# EAGLE design WirelessTRV (EAGLE 6.2)
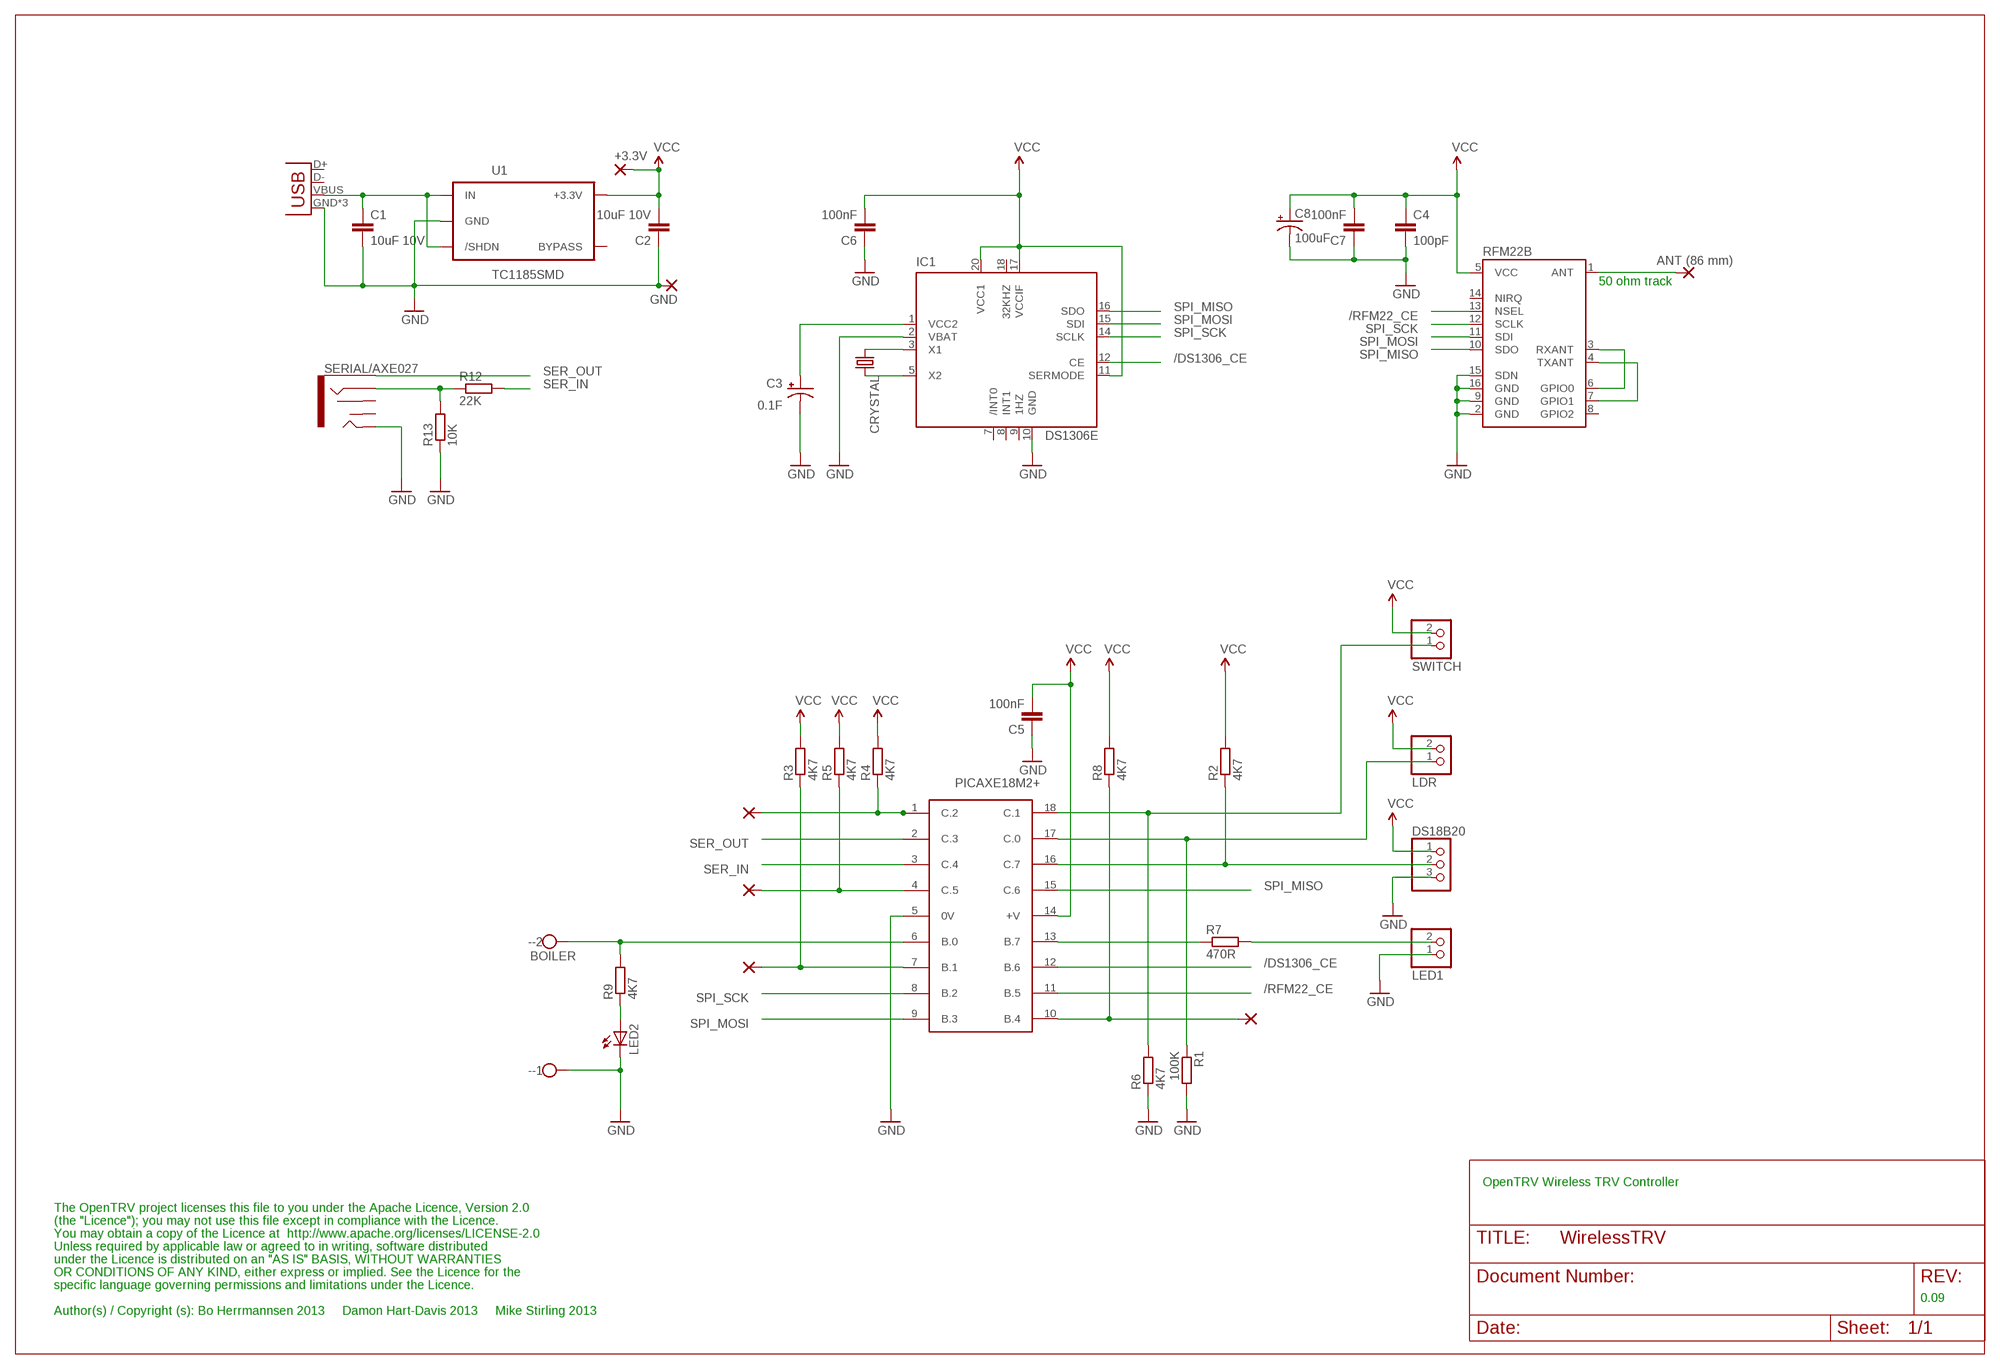
[diagram p0: schematic, sheet 1]

## Parts
1  2,15/1,0  [2,15/1,0]
4  2,15/1,0  [2,15/1,0]
5V  USB-MICROB  [USB-MICROB]
7  2,15/1,0  [2,15/1,0]
10  2,15/1,0  [2,15/1,0]
+3.3V  2,15/1,0  [2,15/1,0]
-  BOILER  W237-102  [W237-102]
ANT  ANT (86 mm)  2,15/1,0  [2,15/1,0]
C1  10uF 10V  CAP0603-CAP  [0603-CAP]
C2  10uF 10V  CAP0603-CAP  [0603-CAP]
C3  0.1F  SUPERCAP3.6VSUPERCAP3.6V  [SUPERCAP3.6V]
C4  100pF  CAP0603-CAP  [0603-CAP]
C5  100nF  CAP0603-CAP  [0603-CAP]
C6  100nF  CAP0603-CAP  [0603-CAP]
C7  100nF  CAP0603-CAP  [0603-CAP]
C8  100uF  CAP_POL1206  [EIA3216]
CRYSTAL  MC-306  [MC-306]
DS18B20  PINHD-1X3  [1X03]
GND  2,15/1,0  [2,15/1,0]
IC1  DS1306E  [TSSOP20]
LDR  PINHD-1X2  [1X02]
LED1  PINHD-1X2  [1X02]
LED2  LED2012  [LED2012]
PICAXE18M2+  PICAXE18M2SO  [SO-18W]
R1  100K  R-EU_R0603  [R0603]
R2  4K7  R-EU_R0603  [R0603]
R3  4K7  R-EU_R0603  [R0603]
R4  4K7  R-EU_R0603  [R0603]
R5  4K7  R-EU_R0603  [R0603]
R6  4K7  R-EU_R0603  [R0603]
R7  470R  R-EU_R0603  [R0603]
R8  4K7  R-EU_R0603  [R0603]
R9  4K7  R-EU_R0603  [R0603]
R12  22K  R-EU_R0603  [R0603]
R13  10K  R-EU_R0603  [R0603]
RFM22B  RFM22SMD  [RFM22-XXX-S2]
SERIAL/AXE027  AUDIO-JACK2SMD  [AUDIO-JACK-3.5MM-SMD]
SWITCH  PINHD-1X2  [1X02]
U1  TC1185SMD  [TC1185]

## Nets
/DS1306_CE: IC1.12(CE) PICAXE18M2+.12(B.6)
/RFM22_CE: PICAXE18M2+.11(B.5) RFM22B.13(NSEL)
BOILER: -.2 PICAXE18M2+.6(B.0) R9.2
GND: 5V.GND 5V.MT1(GND) 5V.MT2(GND) -.1 C1.2 C2.1 C3.- C4.2 C5.1 C6.1 C7.1 C8.C(-) DS18B20.3 GND.1(P) IC1.2(VBAT) IC1.10(GND) LED1.1 LED2.2(C) PICAXE18M2+.5(0V) R1.2 R6.1 R13.1 RFM22B.2(GND) RFM22B.9(GND) RFM22B.15(SDN) RFM22B.16(GND) SERIAL/AXE027.TIP U1.2(GND)
LDR: LDR.1 PICAXE18M2+.17(C.0) R1.1
LED: PICAXE18M2+.13(B.7) R7.1
LEDEXT: LED1.2 R7.2
N$1: 10.1(P) PICAXE18M2+.10(B.4) R8.1
N$2: CRYSTAL.1 IC1.3(X1)
N$3: 4.1(P) PICAXE18M2+.4(C.5) R5.1
N$7: R12.1 R13.2 SERIAL/AXE027.RING
N$9: LED2.1(A) R9.1
N$11: 1.1(P) PICAXE18M2+.1(C.2) R4.1
N$15: 7.1(P) PICAXE18M2+.7(B.1) R3.1
N$16: CRYSTAL.4 IC1.5(X2)
N$20: RFM22B.3(RXANT) RFM22B.6(GPIO0)
N$21: RFM22B.4(TXANT) RFM22B.7(GPIO1)
N$23: C3.+ IC1.1(VCC2)
N$25: 5V.VBUS C1.1 U1.1(IN) U1.3(/SHDN)
N$26: ANT.1(P) RFM22B.1(ANT)
ONE_WIRE: DS18B20.2 PICAXE18M2+.16(C.7) R2.1
SER_IN: PICAXE18M2+.3(C.4) R12.2
SER_OUT: PICAXE18M2+.2(C.3) SERIAL/AXE027.SLEEVE
SPI_MISO: IC1.16(SDO) PICAXE18M2+.15(C.6) RFM22B.10(SDO)
SPI_MOSI: IC1.15(SDI) PICAXE18M2+.9(B.3) RFM22B.11(SDI)
SPI_SCK: IC1.14(SCLK) PICAXE18M2+.8(B.2) RFM22B.12(SCLK)
SWITCH: PICAXE18M2+.18(C.1) R6.2 SWITCH.1
VCC: +3.3V.1(P) C2.2 C4.1 C5.2 C6.2 C7.2 C8.A(+) DS18B20.1 IC1.11(SERMODE) IC1.17(VCCIF) IC1.20(VCC1) LDR.2 PICAXE18M2+.14(+V) R2.2 R3.2 R4.2 R5.2 R8.2 RFM22B.5(VCC) SWITCH.2 U1.5(+3.3V)
Unconnected: 5V.D+ 5V.D- IC1.7(/INT0) IC1.8(INT1) IC1.9(1HZ) IC1.18(32KHZ) RFM22B.8(GPIO2) RFM22B.14(NIRQ) SERIAL/AXE027.RSH SERIAL/AXE027.TSH U1.4(BYPASS)

## Notes on the sheet
- 50 ohm track
- OpenTRV Wireless TRV Controller
- The OpenTRV project licenses this file to you under the Apache Licence, Version 2.0
- (the "Licence"); you may not use this file except in compliance with the Licence.
- You may obtain a copy of the Licence at  http://www.apache.org/licenses/LICENSE-2.0
- Unless required by applicable law or agreed to in writing, software distributed
- under the Licence is distributed on an "AS IS" BASIS, WITHOUT WARRANTIES
- OR CONDITIONS OF ANY KIND, either express or implied. See the Licence for the
- specific language governing permissions and limitations under the Licence.
- 0.09
- Author(s) / Copyright (s): Bo Herrmannsen 2013     Damon Hart-Davis 2013     Mike Stirling 2013

## Library data of the parts
1 4 7 10 +3.3V ANT GND = wirepad:2,15/1,0: THROUGH-HOLE PAD
5V = SparkFun-Connectors:USB: USB Connectors USB-B-PTH is fully proven SKU : PRT-00139 USB-miniB is fully proven SKU : PRT-00587 USB-A-PCB is untested. USB-A-H is throughly reviewed, but untested. Spark Fun Electronics SKU : PRT-00437 USB-B-SMT is throughly reviewed, but untested. Needs silkscreen touching up. USB-A-S has not been used/tested USB-MB-H has not been used/tested
- = con-wago-500:W237-102: WAGO SCREW CLAMP; MPN: 237-102; OC_FARNELL: unknown; OC_NEWARK: 70K9898
C1 C2 C4-C7 = SparkFun-Passives:CAP: Capacitor Standard 0603 ceramic capacitor, and 0.1" leaded capacitor.
C3 = supwecap3.6v:SUPERCAP3.6V: Capacitor Polarized These are standard SMD and PTH capacitors. Normally 10uF, 47uF, and 100uF in electrolytic and tantalum varieties. Always verify the external diameter of the through hole cap, it varies with capacity, voltage, and manufacturer. The EIA devices should be standard.
C8 = SparkFun-Passives:CAP_POL: Capacitor Polarized These are standard SMD and PTH capacitors. Normally 10uF, 47uF, and 100uF in electrolytic and tantalum varieties. Always verify the external diameter of the through hole cap, it varies with capacity, voltage, and manufacturer. The EIA devices should be standard.
CRYSTAL = crystal:MC-306: kHz RANGE CRYSTAL UNIT SMD Source: MC-306_405_406_E07X.PDF Homepage <http://www.epsontoyocom.co.jp>; MPN: MC-306 60.0KHZ 100PPM ,12.5PF; OC_FARNELL: 1278040; OC_NEWARK: 31M5576
DS18B20 = pinhead:PINHD-1X3: PIN HEADER
IC1 = DS1306:DS1306: Serial Alarm Real-Time Clock
LDR LED1 SWITCH = pinhead:PINHD-1X2: PIN HEADER
LED2 = LED2012:LED2012
PICAXE18M2+ = picaxe18m2:PICAXE18M2: PICAXE-18M2 BASIC Microcontroller
R1-R9 R12 R13 = resistor:R-EU_: RESISTOR, European symbol
RFM22B = SparkFun-RF:RFM22: The RFM22 is a low-power, low cost radio that is capable of operating in the 434MHz and 900MHz open bands. It's frequency is software defined and there are some very good libraries written for it.
SERIAL/AXE027 = SparkFun-Connectors:AUDIO-JACK2: Stereo audio jack with bypass switches.
U1 = 3.3VREG:TC1185

## Board
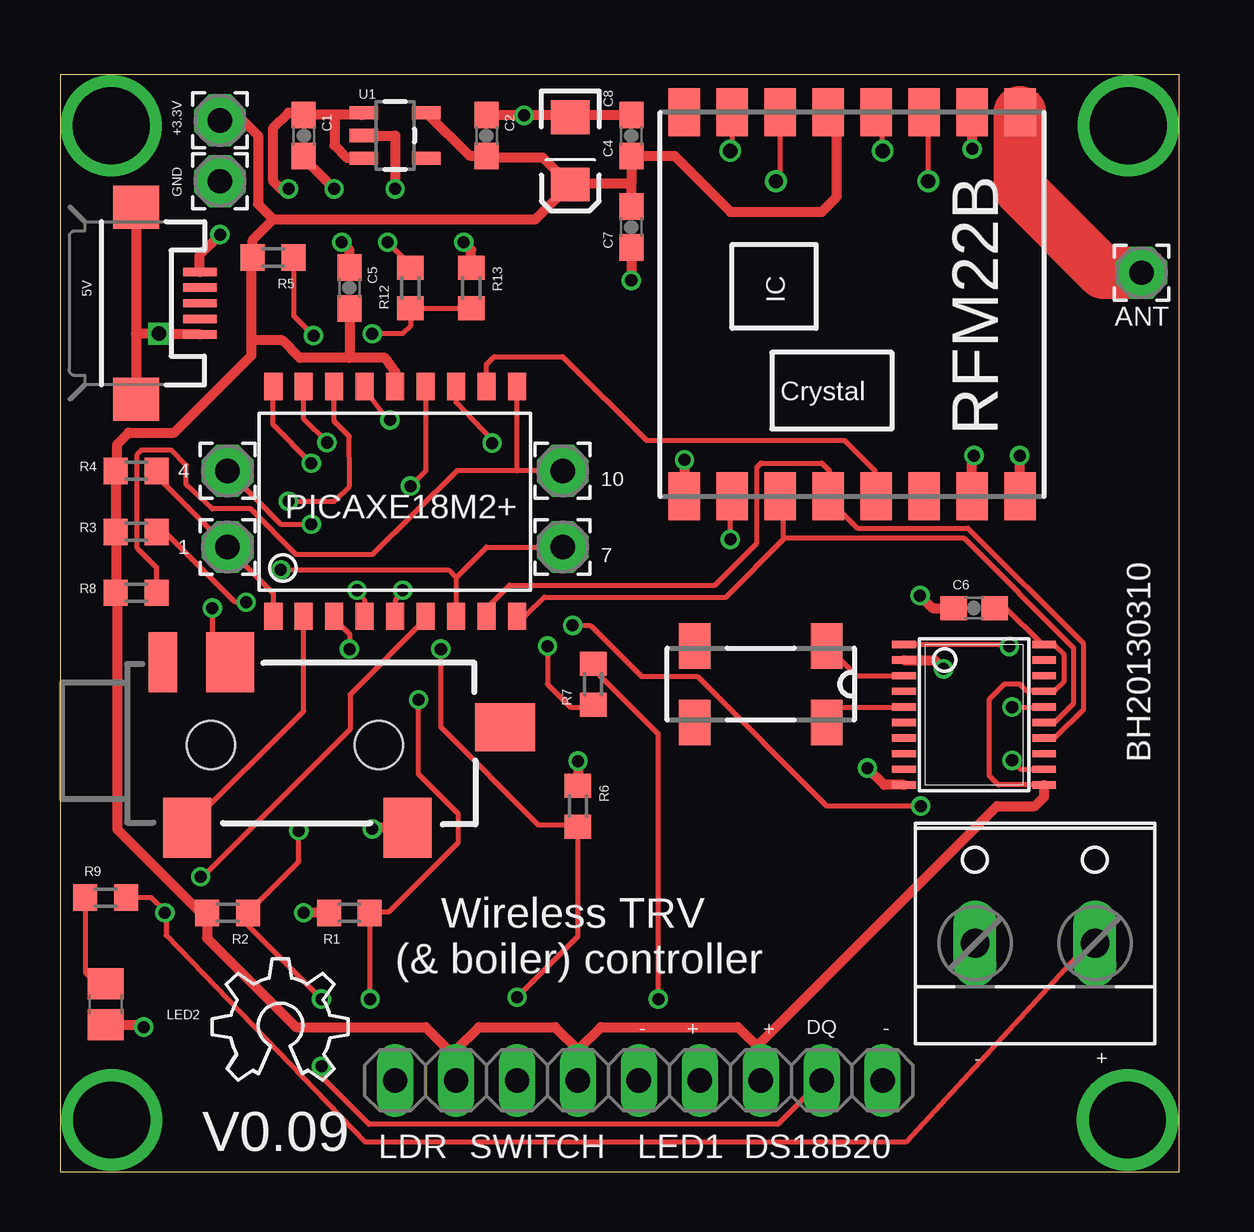
[diagram p1: board, top side]
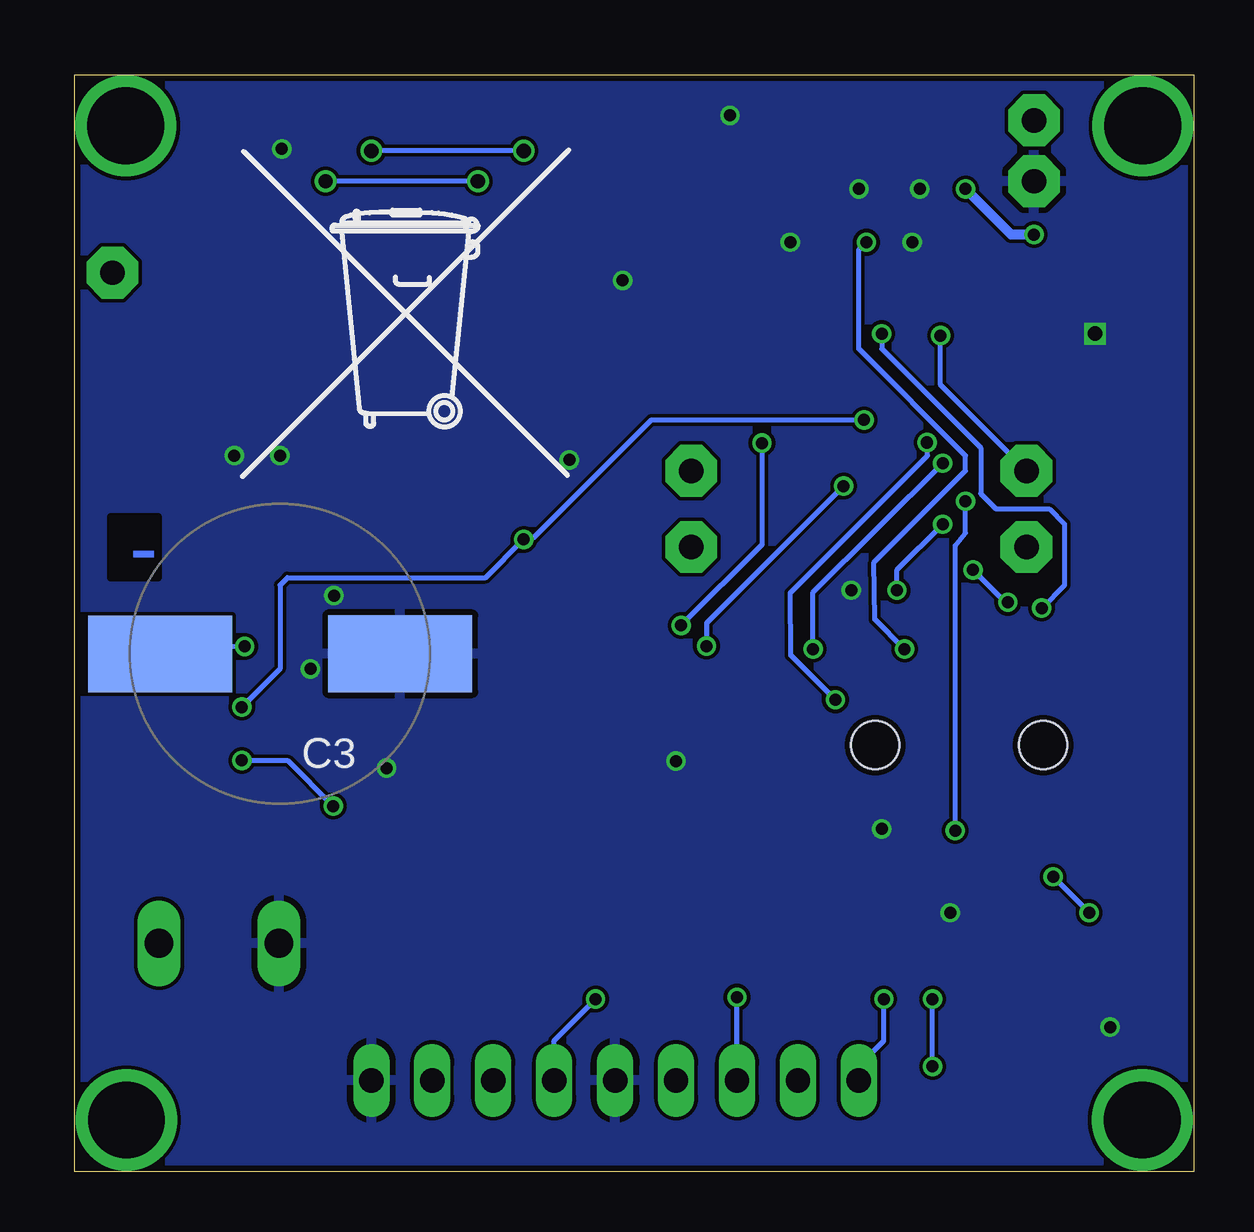
[diagram p2: board, bottom side, seen from below]

Size 46.66 x 45.71 mm. Coordinates in mm from the lower left corner, seen from the top.
Outline: 0,0 46.66,0 46.66,45.71 0,45.71 0,0
Copper layers (1*16): Top 0.035mm / dielectric 1.5mm / Bottom 0.035mm
Design rules: minimum track width 6mil, minimum drill 12mil, track to track 6mil, track to pad 6mil, pad to pad 6mil, via to via 6mil, smd to smd 0mil, copper to edge 10mil, drill to drill 10mil, minimum pad ring 10mil, minimum via ring 6mil, stop-mask expansion 2mil, vias tented up to drill 100mil, thermal gap 10mil

### Footprints (pad centres in the part's own frame; a part is rotated, then mirrored left to right if it is on the bottom)
2,15/1,0 = drill 1.016 pad 2.159 octagon: 1 0,0
USB-MICROB = smd 0.35 x 1.4: D+ 0,2.65; D- -0.65,2.65; GND 1.3,2.65; ID 0.65,2.65; VBUS -1.3,2.65 | smd 1.8 x 1.9: MT1 -4,0; MT2 4,0
W237-102 = drill 1.194 long: 1 -2.5,-1.27; 2 2.5,-1.27
0603-CAP = smd 1.1 x 1: 1 -0.85,0; 2 0.85,0
SUPERCAP3.6V = smd 6 x 3.2: + 4.99,0.01; - -5.01,0
EIA3216 = smd 1.4 x 1.6: A 1.4,0; C -1.4,0
MC-306 = smd 1.3 x 1.9: 1 -2.75,-1.6; 2 2.75,-1.6; 3 2.75,1.6; 4 -2.75,1.6
1X03 = drill 1.016 long: 1 -2.54,0; 2 0,0; 3 2.54,0
TSSOP20 = smd 0.305 x 0.991: 1 -2.925,-2.918; 2 -2.275,-2.918; 3 -1.625,-2.918; 4 -0.975,-2.918; 5 -0.325,-2.918; 6 0.325,-2.918; 7 0.975,-2.918; 8 1.625,-2.918; 9 2.275,-2.918; 10 2.925,-2.918; 11 2.925,2.918; 12 2.275,2.918; 13 1.625,2.918; 14 0.975,2.918; 15 0.325,2.918; 16 -0.325,2.918; 17 -0.975,2.918; 18 -1.625,2.918; 19 -2.275,2.918; 20 -2.925,2.918
1X02 = drill 1.016 long: 1 -1.27,0; 2 1.27,0
LED2012 = smd 1.3 x 1.5: 1 -0.85,0; 2 0.85,0
SO-18W = smd 0.762 x 1.143: 1 -5.08,-4.788; 2 -3.81,-4.788; 3 -2.54,-4.788; 4 -1.27,-4.788; 5 0,-4.788; 6 1.27,-4.788; 7 2.54,-4.788; 8 3.81,-4.788; 9 5.08,-4.788; 10 5.08,4.788; 11 3.81,4.788; 12 2.54,4.788; 13 1.27,4.788; 14 0,4.788; 15 -1.27,4.788; 16 -2.54,4.788; 17 -3.81,4.788; 18 -5.08,4.788
R0603 = smd 1 x 1.1: 1 -0.85,0; 2 0.85,0
RFM22-XXX-S2 = smd 2 x 1.3: 1 -8,7; 2 -8,5; 3 -8,3; 4 -8,1; 5 -8,-1; 6 -8,-3; 7 -8,-5; 8 -8,-7; 9 8,-7; 10 8,-5; 11 8,-3; 12 8,-1; 13 8,1; 14 8,3; 15 8,5; 16 8,7
AUDIO-JACK-3.5MM-SMD = smd 2 x 2.5: RING 4.3,3.45; SLEEVE 2.5,-3.45; TIP 11.7,-3.45 | smd 1.2 x 2.5: RSH 1.5,3.45 | smd 2.5 x 2: TSH 15.75,0.75 | hole 2: 3.5,0; 10.5,0
TC1185 = smd 0.55 x 1.2: 1 -0.95,-1.3; 2 0,-1.3; 3 0.95,-1.3; 4 0.95,1.3; 5 -0.95,1.3

### Placement (x,y rotation side)
1  6.99,26.04 90 top
4  6.99,29.21 90 top
5V  3.17,36.2 270 top
7  20.95,26.04 90 top
10  20.95,29.21 90 top
+3.3V  6.67,43.81 0 top
-  40.64,10.79 0 top
ANT  45.09,37.47 180 top
C1  10.16,43.18 270 top
C2  17.78,43.18 270 top
C3  38.1,21.59 180 bottom
C4  23.81,43.18 90 top
C5  12.06,36.83 270 top
C6  38.1,23.5 0 top
C7  23.81,39.37 90 top
C8  21.27,42.55 270 top
CRYSTAL  29.21,20.32 180 top
DS18B20  31.75,3.81 0 top
GND  6.67,41.27 0 top
IC1  38.1,19.05 270 top
LDR  15.24,3.81 0 top
LED1  25.4,3.81 0 top
LED2  1.91,6.99 270 top
PICAXE18M2+  13.97,27.94 0 top
R1  12.06,10.79 180 top
R2  6.99,10.79 180 top
R3  3.17,26.67 180 top
R4  3.17,29.21 180 top
R5  8.89,38.1 180 top
R6  21.59,15.24 270 top
R7  22.23,20.32 90 top
R8  3.17,24.13 180 top
R9  1.91,11.43 0 top
R12  14.61,36.83 90 top
R13  17.14,36.83 270 top
RFM22B  33.02,36.14 270 top
SERIAL/AXE027  2.79,17.78 0 top
SWITCH  20.32,3.81 0 top
U1  13.97,43.18 270 top
U$2  [TONNE]  33.02,33.02 0 bottom
U$3  [OSHW_6X200_NOTEXT]  6.35,3.81 0 top

### Tracks (layer width: path | path; a pad name or v marks a point on that pad's centre or on a via)
/DS1306_CE  (via drill 0.5)
  Top 0.203: v21.37,22.77 22.11,22.77 24.23,20.65 26.57,20.65 31.98,15.24 v35.88,15.24 | v18.01,30.37 18.01,30.48 16.51,32.07 PICAXE18M2+.12 | IC1.12 41,16.76 40.07,16.76 v39.69,17.14
  Bottom 0.203: v21.37,22.77 18.01,26.14 v18.01,30.37 | v39.69,17.14 37.78,17.14 v35.88,15.24
/RFM22_CE
  Top 0.203: PICAXE18M2+.11 17.78,33.66 18.1,33.97 20.95,33.97 24.45,30.48 32.7,30.48 33.97,29.21 33.97,28.19 RFM22B.13
BOILER  (via drill 0.5)
  Top 0.203: R9.2 3.81,11.43 4.37,10.87 v4.37,10.79 4.42,10.72 4.42,9.86 12.7,1.26 35.29,1.26 42.61,9.21 -.2 | v5.87,12.29 5.94,12.29 12.09,18.44 12.09,19.89 15.24,23.04 PICAXE18M2+.6
  Bottom 0.203: v5.87,12.29 v4.37,10.79
GND  (via drill 0.5, 0.6)
  Top 0.203: 21.54,44.02 21.59,43.97 C8.C | 17.78,44.02 C2.1 | IC1.10 | RFM22B.15 | 40.01,28.14 RFM22B.16 | RFM22B.2 38.02,44.04 | RFM22B.9 26.04,28.25 | v14.29,24.23 14.29,24.13 13.97,23.81 PICAXE18M2+.5
  Top 0.406: 21.54,44.02 v19.34,44.02 17.78,44.02 | v21.59,17.12 R6.1 | C6.1 36.37,23.5 v35.85,24.02 | v26.04,29.67 26.04,28.25 | v38.02,42.62 38.02,44.04 | U1.2 13.97,43.18 v13.97,40.96 | C1.2 10.16,42.23 v11.43,40.96 | C4.2 21.36,44.03 C8.C | C7.1 v23.81,37.15 | C5.1 12.06,38.42 v11.75,38.73 | R13.1 17.14,38.42 v16.83,38.73 | RFM22B.15 38.02,29.77 v38.1,29.84 | RFM22B.16 v40.02,29.83 v40.01,29.84 | LED2.2 3.39,6.13 v3.49,6.03 | R1.2 v10.16,10.79 | IC1.2 36.46,21.32 v36.83,20.95 | IC1.10 34.36,16.12 v33.66,16.83 | SERIAL/AXE027.TIP 13.06,14.33 v13.02,14.29 | 5V.GND 4.13,34.9 v4.13,34.92 3.17,34.92 | 3.17,34.92 5V.MT2 | 5V.MT1 3.17,34.92
  pour Bottom: 0,45.72 0,0 46.99,0 46.35,45.72
LDR  (via drill 0.5)
  Top 0.203: v12.93,7.2 12.93,10.79 R1.1 13.01,10.85 13.72,10.85 16.61,13.74 16.61,14.91 14.95,16.57 v14.95,19.67 | PICAXE18M2+.17 10.16,31.36 v11.12,30.39
  Bottom 0.203: v12.93,7.2 12.93,5.46 13.97,4.42 LDR.1 | v11.12,30.39 11.11,29.84 16.83,24.13 16.8,21.53 v14.95,19.67
LED  (via drill 0.5)
  Top 0.203: PICAXE18M2+.13 15.24,29.21 v14.61,28.57 | v20.32,21.91 20.32,20.32 21.27,19.37 22.12,19.37 R7.1
  Bottom 0.203: v14.61,28.57 20.32,22.86 v20.32,21.91
LEDEXT  (via drill 0.5)
  Top 0.203: R7.2 22.23,20.95 24.94,18.24 v24.94,7.2
  Bottom 0.203: v24.94,7.2 26.67,5.47 LED1.2
N$1
  Top 0.203: 10.1 19.05,29.21 | 19.05,29.21 16.55,29.21 13.02,25.72 9.84,25.72 7.94,27.62 6.35,27.62 5.27,28.63 5.27,29.45 4.65,30.07 3.4,30.07 3.2,29.87 3.2,26.01 4.01,25.2 R8.1 | 19.05,29.21 PICAXE18M2+.10
N$2
  Top 0.203: IC1.3 33.2,20.68 31.98,21.89 CRYSTAL.1
N$3  (via drill 0.5)
  Top 0.203: v10.57,34.85 9.75,35.66 9.75,38.1 R5.1 | v12.38,24.23 12.7,23.81 PICAXE18M2+.4 | v10.48,26.99 9.21,26.99 7.01,29.21 4.1
  Bottom 0.203: v10.57,34.85 10.57,32.79 4.1 | v12.38,24.23 12.38,25.08 v10.48,26.99
N$4  (via drill 3.2)
  other vias: 2.13,43.59
N$7  (via drill 0.5)
  Top 0.203: R13.2 R12.1 14.61,35.24 14.29,34.92 v13.02,34.92 | v6.35,23.5 6.35,21.97 SERIAL/AXE027.RING
  Bottom 0.203: v13.02,34.92 13.02,34.29 8.89,30.16 8.89,28.26 8.26,27.62 6.03,27.62 5.4,26.99 5.4,24.45 v6.35,23.5
N$9
  Top 0.203: R9.1 1.07,8.31 1.42,7.95 LED2.1
N$11
  Top 0.203: R4.1 4.04,29.21 4.04,28.98 1.1 7.04,25.96 8.89,24.11 8.89,23.16 PICAXE18M2+.1
N$12  (via drill 3.2)
  other vias: 44.5,2.16
N$15  (via drill 0.5)
  Top 0.203: R3.1 4.37,26.67 7.3,23.74 v7.76,23.74 | v9.21,25.08 16.19,25.08 16.51,24.77 | 16.51,24.77 PICAXE18M2+.7 | 16.51,24.77 17.78,26.04 7.1
  Bottom 0.203: v7.76,23.74 7.86,23.74 v9.21,25.08
N$16
  Top 0.203: IC1.5 35.18,19.36 32.59,19.36 31.98,18.75 CRYSTAL.4
N$19  (via drill 3.2)
  other vias: 44.53,43.59
N$20  (via drill 0.6)
  Top 0.203: RFM22B.6 30.02,41.45 v29.84,41.27 | v36.2,41.27 36.2,43.97 RFM22B.3
  Bottom 0.203: v29.84,41.27 v36.2,41.27
N$21  (via drill 0.6)
  Top 0.203: RFM22B.7 28.02,42.62 v27.94,42.55 | v34.29,42.55 34.29,43.87 RFM22B.4
  Bottom 0.203: v27.94,42.55 v34.29,42.55
N$22  (via drill 3.2)
  other vias: 2.16,2.16
N$23  (via drill 0.5)
  Top 0.203: v39.57,21.89 39.5,21.97 35.2,21.97 IC1.1
  Bottom 0.203: v39.57,21.89 42.77,21.89 43.08,21.59 C3.+
N$25  (via drill 0.5)
  Top 0.203: 12.57,44.04 12.65,44.12 U1.1 | 10.16,44.04 C1.1 | U1.3 12.65,42.23 12.65,42.24
  Top 0.406: 12.57,44.04 11.44,44.04 | 11.44,44.04 10.16,44.04 | 11.44,44.04 11.44,42.77 11.98,42.24 12.29,42.24 12.3,42.23 12.65,42.23 | 5V.VBUS 5.83,38.21 v6.67,39.05 | v9.53,40.96 9.21,40.96 8.89,41.27 8.89,43.5 9.53,44.13 10.06,44.13 C1.1
  Bottom 0.406: v6.67,39.05 7.62,39.05 v9.53,40.96
N$26
  Top 2.184: RFM22B.1 40.01,42.87 40.01,40.96 43.5,37.47 ANT.1
ONE_WIRE  (via drill 0.5)
  Top 0.203: v10.9,7.2 7.85,10.25 7.85,10.79 R2.1 7.9,10.87 9.96,12.93 v9.96,14.22 | v10.9,4.39 10.9,3.96 12.88,1.98 29.92,1.98 DS18B20.2 | PICAXE18M2+.16 11.43,31.27 12.05,30.64 12.06,28.89 12.06,28.57 11.43,27.94 v9.53,27.94
  Bottom 0.203: v10.9,4.39 v10.9,7.2 | v9.53,27.94 9.53,26.62 9.96,26.1 v9.96,14.22
SER_IN  (via drill 0.5)
  Top 0.203: v12.06,21.78 12.06,22.4 11.43,23.04 PICAXE18M2+.3 | R12.2 14.61,37.78 v13.65,38.73
  Bottom 0.203: v13.65,38.73 13.97,38.42 13.97,34.29 9.53,29.84 9.53,29.21 13.34,25.4 13.31,23.02 v12.06,21.78
SER_OUT
  Top 0.203: PICAXE18M2+.2 10.16,23.14 10.16,19.2 5.31,14.35 SERIAL/AXE027.SLEEVE
SPI_MISO  (via drill 0.5)
  Top 0.203: PICAXE18M2+.15 12.7,32.61 13.66,31.33 v13.75,31.33 | v27.94,26.35 27.94,28.06 RFM22B.10 | v39.69,19.37 41.01,19.37 IC1.16
  Bottom 0.203: v13.75,31.33 22.62,31.33 27.51,26.44 27.85,26.44 v27.94,26.35 29.53,24.77 37.78,24.77 38.1,24.45 38.1,20.95 v39.69,19.37
SPI_MOSI
  Top 0.203: 30.02,28.04 RFM22B.11 30.16,28 30.16,26.35 | IC1.15 41.02,18.75 41.48,18.75 42.24,19.51 42.24,21.84 37.67,26.42 30.23,26.42 30.16,26.35 | PICAXE18M2+.9 19.05,23.16 19.41,23.16 20.19,23.95 27.76,23.95 30.16,26.35
SPI_SCK
  Top 0.203: IC1.14 41.02,18.09 41.48,18.09 42.65,19.25 42.65,22.02 37.85,26.82 33.25,26.82 32.03,28.04 RFM22B.12 32.07,28.19 32.07,29.21 31.75,29.53 29.21,29.53 29.05,29.37 29.05,26.19 27.3,24.45 18.73,24.45 17.78,23.5 PICAXE18M2+.8
SWITCH  (via drill 0.5)
  Top 0.203: v19.05,7.28 21.59,9.82 R6.2 21.51,14.45 19.94,14.45 15.88,18.52 v15.88,21.78 | PICAXE18M2+.18 8.89,31.13 v10.48,29.53
  Bottom 0.203: SWITCH.1 v19.05,7.28 | v10.48,29.53 15.88,24.14 v15.88,21.78
VCC
  Top 0.203: 2.34,24.13 R8.2 2.39,24.05 | 2.34,26.67 R3.2 2.34,26.75 | 2.34,29.21 R4.2 2.39,29.29 2.39,29.64 | 7.98,38.02 R5.2 | 41.02,20.04 41.48,20.04 41.83,20.4 41.83,21.59 41.45,21.97 IC1.20 40.92,22 39.42,23.5 C6.2 | 41.02,20.04 IC1.17 | 17.78,42.34 C2.2 17.86,42.27 | 32,43.46 32,44.12 RFM22B.5 | 21.03,41.2 C8.A 21.2,41.2 | 8.05,34.65 7.98,34.7 | 13.92,32.92 PICAXE18M2+.14 | 5.82,10.85 6.04,10.85 R2.2 | U1.5 15.29,44.13 15.29,44.12 | IC1.11 39.12,16.12 38.73,16.51 38.73,19.68 39.37,20.32 40.01,20.32 40.28,20.04 41.02,20.04
  Top 0.406: 2.34,26.67 2.34,24.13 | 2.34,26.75 2.34,29.21 | 7.98,38.02 7.98,34.7 7.98,34.01 4.76,30.8 2.86,30.8 2.39,30.33 2.39,29.64 | 17.78,42.34 17.07,42.34 15.29,44.12 | 21.03,41.2 21.2,41.2 | 21.2,41.2 23.81,41.2 | 17.86,42.27 20.13,42.27 21.2,41.2 | 8.05,34.65 9.27,34.65 9.99,33.92 12.06,33.92 | 12.06,33.92 13.55,33.92 13.97,33.34 13.92,33.29 13.92,32.92 | 5.82,10.85 2.39,14.28 2.39,24.05 | 23.81,41.2 C4.1 25.61,42.33 27.94,40.01 31.75,40.01 32.38,40.64 32.38,43.78 RFM22B.5 | C7.2 23.81,41.2 | +3.3V.1 7.62,43.81 8.26,43.18 8.26,40.32 8.89,39.69 | 8.89,39.69 19.82,39.69 C8.A | R5.2 8.04,38.84 8.89,39.69 | C5.2 12.06,33.92 | DS18B20.1 29.21,5.08 | 29.21,5.08 29.21,5.4 39.05,15.24 40.64,15.24 41.02,15.62 IC1.11 | R2.2 6.13,9.74 9.84,6.03 15.24,6.03 16.51,4.76 LDR.2 16.51,5.08 17.46,6.03 20.64,6.03 21.59,5.08 | SWITCH.2 21.59,5.08 | 21.59,5.08 22.54,6.03 28.26,6.03 29.21,5.08

### Text on the board
Bottom: -
tNames: BH20130310 | Wireless TRV | (& boiler) controller | - | + | + | DQ | - | - | + | V0.09